# Altium project Grove Adapter.PrjPcb
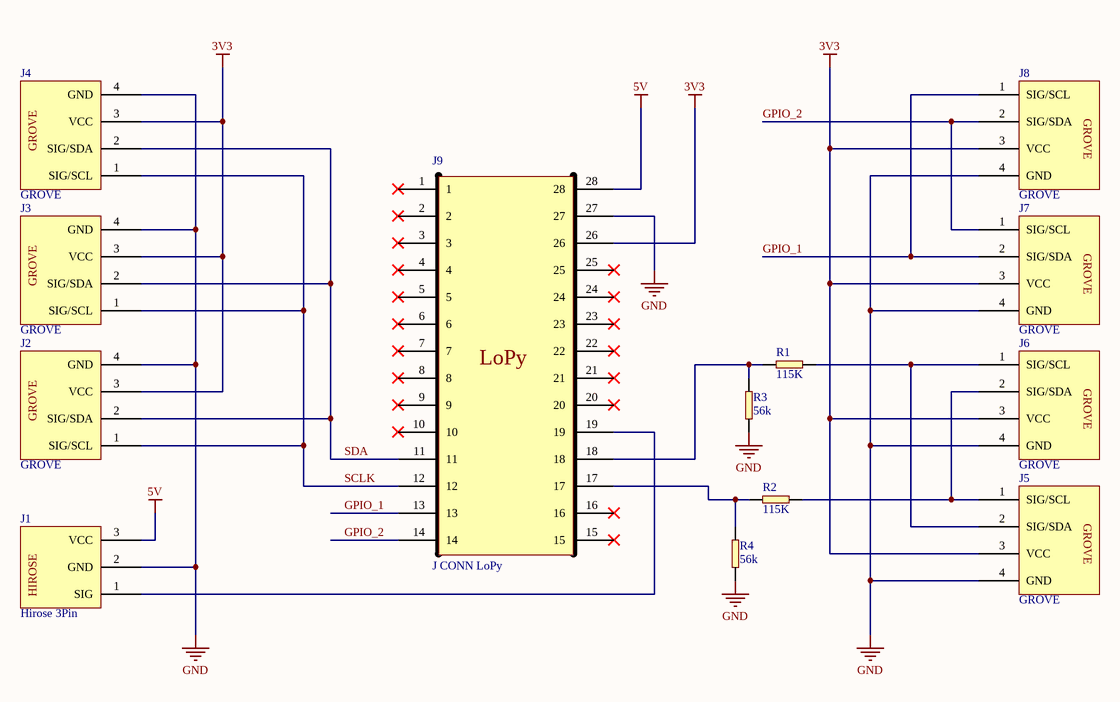
[diagram p0: GroveAdapter.SchDoc]
1 sheet, 13 parts. Net scope: global (net labels, ports and power ports of the same name join across sheets).
Board file: GroveAdapter.PcbDoc

## Sheet GroveAdapter.SchDoc: Pycom Grove Shield
size A4; Organization: NSIL, Physics Section; Address1: nsil@iaea.org; Address2: IAEA Laboratories; Address3: Seibersdorf; Address4: Austria; Revision: 1.0; SheetNumber: 1; SheetTotal: 1; Licence: CC BY SA

### Parts
J1  value Hirose 3Pin  [Hirose 3P]  (hidden comment: J CONN Hirose 3Pin)
J2  value GROVE  [grove]  (hidden comment: J CONN 4POS GROVE MALE)
J3  value GROVE  [grove]  (hidden comment: J CONN 4POS GROVE MALE)
J4  value GROVE  [grove]  (hidden comment: J CONN 4POS GROVE MALE)
J5  value GROVE  [grove]  (hidden comment: J CONN 4POS GROVE MALE)
J6  value GROVE  [grove]  (hidden comment: J CONN 4POS GROVE MALE)
J7  value GROVE  [grove]  (hidden comment: J CONN 4POS GROVE MALE)
J8  value GROVE  [grove]  (hidden comment: J CONN 4POS GROVE MALE)
J9  J CONN LoPy  [LoPy]
R1  value 115K  [SMD0402]  (hidden comment: RES 115k (0402))
R2  value 115K  [SMD0402]  (hidden comment: RES 115k (0402))
R3  value 56k  [SMD0402]  (hidden comment: RES 56K (0402))
R4  value 56k  [SMD0402]  (hidden comment: RES 56K (0402))

### Nets
3V3: J2.3(VCC) J3.3(VCC) J4.3(VCC) J5.3(VCC) J6.3(VCC) J7.3(VCC) J8.3(VCC) J9.26
5V: J1.3(VCC) J9.28
GND: J1.2(GND) J2.4(GND) J3.4(GND) J4.4(GND) J5.4(GND) J6.4(GND) J7.4(GND) J8.4(GND) J9.27 R3.1 R4.1
GPIO_1: J7.2(SIG/SDA) J8.1(SIG/SCL) J9.13
GPIO_2: J7.1(SIG/SCL) J8.2(SIG/SDA) J9.14
SCLK: J2.1(SIG/SCL) J3.1(SIG/SCL) J4.1(SIG/SCL) J9.12
SDA: J2.2(SIG/SDA) J3.2(SIG/SDA) J4.2(SIG/SDA) J9.11
NetJ1_1: J1.1(SIG) J9.19
NetJ5_1: J5.1(SIG/SCL) J6.2(SIG/SDA) R2.2
NetJ5_2: J5.2(SIG/SDA) J6.1(SIG/SCL) R1.2
NetJ9_17: J9.17 R2.1 R4.2
NetJ9_18: J9.18 R1.1 R3.2

Not connected (* = marked no-connect by the designer): J9 1* 2* 3* 4* 5* 6* 7* 8* 9* 10* 15* 16* 20* 21* 22* 23* 24* 25*

### Notes on the sheet
- Title
- Size:
- Date:
- A4
- Number:
- Revision:
- Sheet
- of
- File:
- (in symbol J CONN Hirose 3Pin) HIROSE
- (in symbol J CONN LoPy) LoPy

### Library data of the parts
J1 = J CONN Hirose 3Pin: Header 3pos 2mm Vert; Manufacturer 1: Hirose Electric Co Ltd; Manufacturer 1 P/N: DF3A-3P-2DSA; Supplier 1: Digikey; Supplier 1 P/N: H2095-ND
J2-J8 = J CONN 4POS GROVE MALE: 4 Pin Grove Connector T.H. Straight; Manufacturer 1: SEEED; Manufacturer 1 P/N: 110990030; Supplier 1: Reichelt; Supplier 1 P/N: GRV CONNEC4PIN
J9 = J CONN LoPy: 2x 14pin .100" PC/104™ Elevated Socket Strips; Manufacturer 1: Samtec; Manufacturer 1 P/N: ESQ-114-14-G-S; Supplier 1: Samtec; Supplier 1 P/N: ESQ-114-14-G-S
R1 R2 = RES 115k (0402): Resistor SMD 0.1 W 1 % 100 ±ppm/°C; Manufacturer 1: Panasonic; Manufacturer 1 P/N: ERJ-2RKF1153X; Package Reference: SMD0402; Supplier 1: Conrad; Supplier 1 P/N: 1481207 - 62
R3 R4 = RES 56K (0402): Resistor SMD 63mW 1%; Manufacturer 1: RND Components; Manufacturer 1 P/N: RND1550402WGF5602TCE; Supplier 1: Reichelt; Supplier 1 P/N: RND 0402 1 56K